# EAGLE design Little-Wire (EAGLE 6.1)
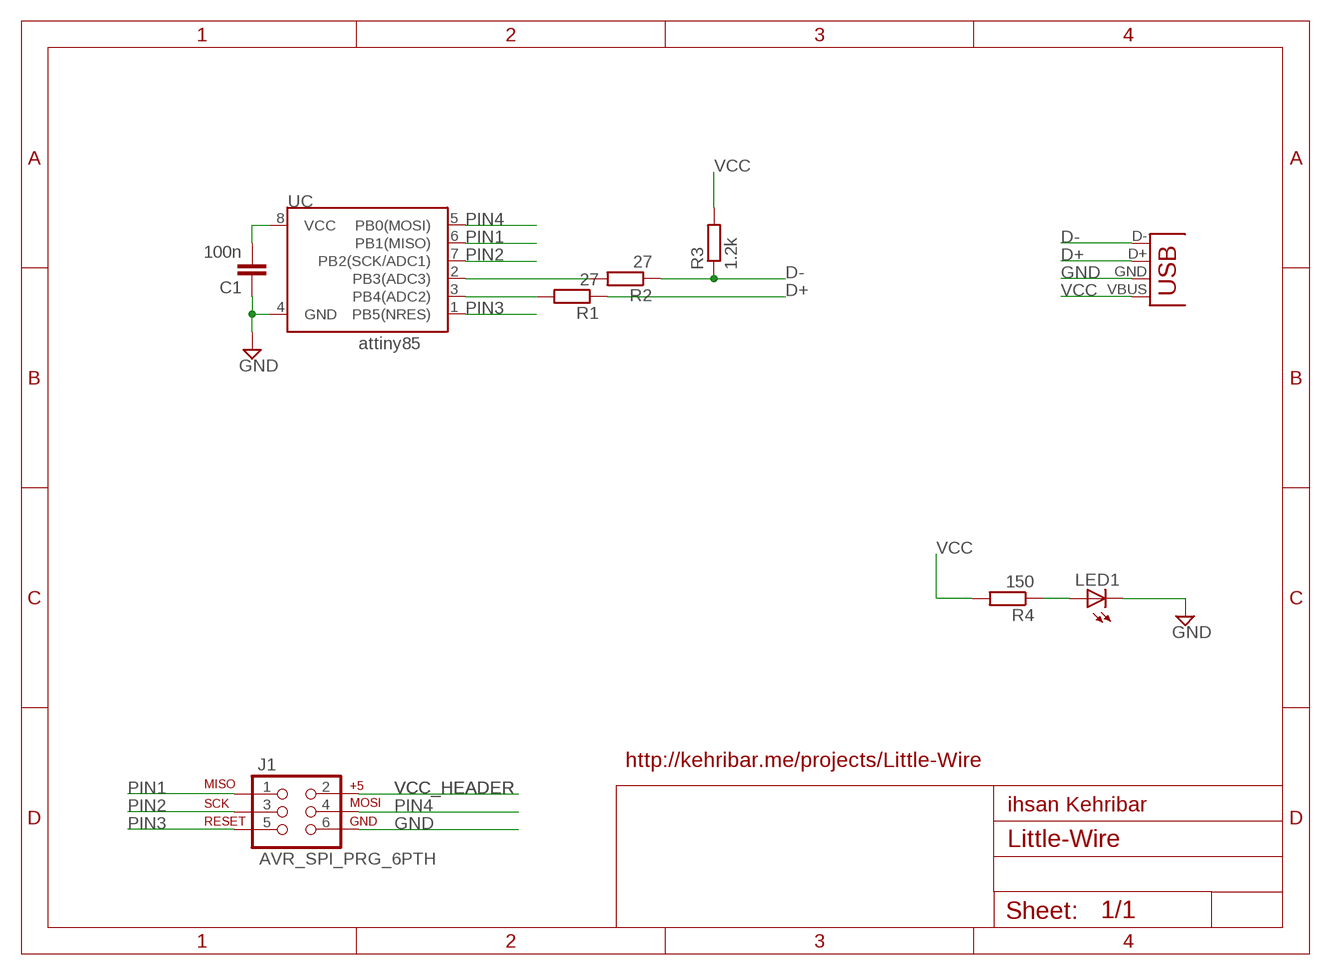
[diagram p0: schematic, sheet 1]

## Parts
C1  100n  C-EU025-025X050  [C025-025X050]
J1  AVR_SPI_PRG_6PTH  [2X3]
LED1  LED3MM  [LED3MM]
R1  27  R-EU_0204/5  [0204/5]
R2  27  R-EU_0204/5  [0204/5]
R3  1.2k  R-EU_0204/5  [0204/5]
R4  150  R-EU_0204/5  [0204/5]
UC  ATTINY45DIP8  [DIP08]
X1  USB-A-H  [USB-A-H]

## Nets
D+: R1.1 X1.D+(D-)
D-: R2.1 R3.1 X1.D-(D+)
GND: C1.1 J1.6 LED1.K(C) UC.4(GND) X1.GND(VBUS)
N$1: R2.2 UC.2(PB3(ADC3))
N$2: R1.2 UC.3(PB4(ADC2))
N$3: LED1.A R4.1
PIN1: J1.1 UC.6(PB1(MISO))
PIN2: J1.3 UC.7(PB2(SCK/ADC1))
PIN3: J1.5 UC.1(PB5(NRES))
PIN4: J1.4 UC.5(PB0(MOSI))
VCC: C1.2 R3.2 R4.2 UC.8(VCC) X1.VBUS(GND)
VCC_HEADER: J1.2

## Notes on the sheet
- attiny85
- http://kehribar.me/projects/Little-Wire
- ihsan Kehribar

## Library data of the parts
C1 = rcl:C-EU: CAPACITOR, European symbol
J1 = SparkFun:AVR_SPI_PRG_6: AVR ISP 6 Pin This is the reduced ISP connector for AVR programming. Common on Arduino. This footprint will take up less PCB space and can be used with a 10-pin to 6-pin adapter such as SKU: BOB-08508
LED1 = led:LED: LED OSRAM: - CHIPLED LG R971, LG N971, LY N971, LG Q971, LY Q971, LO R971, LY R971 LH N974, LH R974 LS Q976, LO Q976, LY Q976 LO Q996 - Hyper CHIPLED LW Q18S LB Q993, LB Q99A, LB R99A - SideLED LS A670, LO A670, LY A670, LG A670, LP A670 LB A673, LV A673, LT A673, LW A673 LH A674 LY A675 LS A676, LA A676, LO A676, LY A676, LW A676 LS A679, LY A679, LG A679 - Hyper Micro SIDELED® LS Y876, LA Y876, LO Y876, LY Y876 LT Y87S - SmartLED LW L88C, LW L88S LB L89C, LB L89S, LG L890 LS L89K, LO L89K, LY L89K LS L896, LA L896, LO L896, LY L896 - TOPLED LS T670, LO T670, LY T670, LG T670, LP T670 LSG T670, LSP T670, LSY T670, LOP T670, LYG T670 LG T671, LOG T671, LSG T671 LB T673, LV T673, LT T673, LW T673 LH T674 LS T676, LA T676, LO T676, LY T676, LB T676, LH T676, LSB T676, LW T676 LB T67C, LV T67C, LT T67C, LS T67K, LO T67K, LY T67K, LW E67C LS E67B, LA E67B, LO E67B, LY E67B, LB E67C, LV E67C, LT E67C LW T67C LS T679, LY T679, LG T679 LS T770, LO T770, LY T770, LG T770, LP T770 LB T773, LV T773, LT T773, LW T773 LH T774 LS E675, LA E675, LY E675, LS T675 LS T776, LA T776, LO T776, LY T776, LB T776 LHGB T686 LT T68C, LB T68C - Hyper Mini TOPLED® LB M676 - Mini TOPLED Santana® LG M470 LS M47K, LO M47K, LY M47K Source: http://www.osram.convergy.de LUXEON: - LUMILED® LXK2-PW12-R00, LXK2-PW12-S00, LXK2-PW14-U00, LXK2-PW14-V00 LXK2-PM12-R00, LXK2-PM12-S00, LXK2-PM14-U00 LXK2-PE12-Q00, LXK2-PE12-R00, LXK2-PE12-S00, LXK2-PE14-T00, LXK2-PE14-U00 LXK2-PB12-K00, LXK2-PB12-L00, LXK2-PB12-M00, LXK2-PB14-N00, LXK2-PB14-P00, LXK2-PB14-Q00 LXK2-PR12-L00, LXK2-PR12-M00, LXK2-PR14-Q00, LXK2-PR14-R00 LXK2-PD12-Q00, LXK2-PD12-R00, LXK2-PD12-S00 LXK2-PH12-R00, LXK2-PH12-S00 LXK2-PL12-P00, LXK2-PL12-Q00, LXK2-PL12-R00 Source: www.luxeon.com KINGBRIGHT: KA-3528ASYC Source: www.kingbright.com
R1-R4 = rcl:R-EU_: RESISTOR, European symbol
UC = SparkFun:ATTINY45: Atmel ATTiny45
X1 = SparkFun:USB: USB Connectors USB-B-PTH is fully proven SKU : PRT-00139 USB-miniB is fully proven SKU : PRT-00587 USB-A-PCB is untested. USB-A-H is throughly reviewed, but untested. Spark Fun Electronics SKU : PRT-00437 USB-B-SMT is throughly reviewed, but untested. Needs silkscreen touching up. USB-A-S has not been used/tested USB-MB-H has not been used/tested

## Board
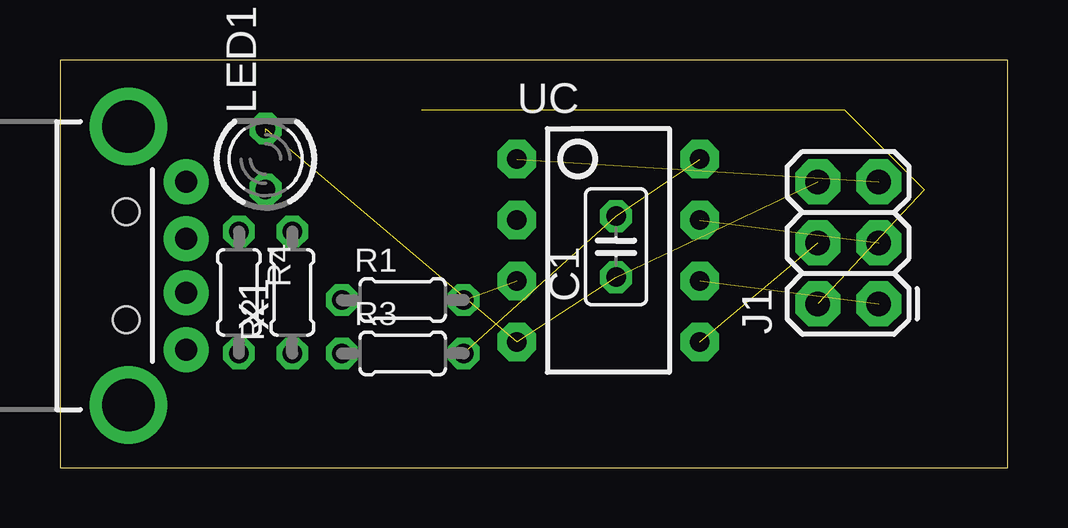
[diagram p1: board, top side]
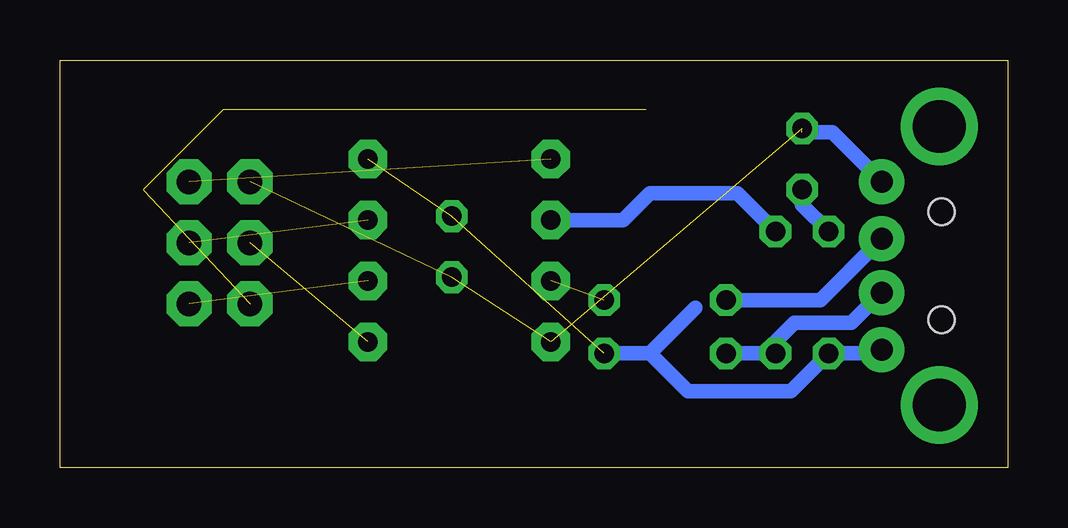
[diagram p2: board, bottom side, seen from below]

Size 39.51 x 16.99 mm. Coordinates in mm from the lower left corner, seen from the top.
Outline: 0,0 39.51,0 39.51,16.97 0,16.99 0,0
Copper layers (1*16): Top 0.035mm / dielectric 1.5mm / Bottom 0.035mm
Design rules: minimum track width 6mil, minimum drill 12mil, track to track 6mil, track to pad 6mil, pad to pad 6mil, via to via 6mil, smd to smd 0mil, copper to edge 10mil, drill to drill 10mil, minimum pad ring 10mil, minimum via ring 6mil, stop-mask expansion 2mil, vias tented up to drill 100mil, thermal gap 10mil

### Footprints (pad centres in the part's own frame; a part is rotated, then mirrored left to right if it is on the bottom)
C025-025X050 = drill 0.813 octagon: 1 -1.27,0; 2 1.27,0
2X3 = drill 1.016 pad 1.88 octagon: 1 0,0; 2 0,2.54; 3 2.54,0; 4 2.54,2.54; 5 5.08,0; 6 5.08,2.54
LED3MM = drill 0.813 octagon: A -1.27,0; K 1.27,0
0204/5 = drill 0.813 octagon: 1 -2.54,0; 2 2.54,0
DIP08 = drill 0.813 pad 1.6 octagon: 1 -3.81,-3.81; 2 -1.27,-3.81; 3 1.27,-3.81; 4 3.81,-3.81; 5 3.81,3.81; 6 1.27,3.81; 7 -1.27,3.81; 8 -3.81,3.81
USB-A-H = drill 0.914 pad 1.88: D+ 2.4,1.127; D- 2.4,-1.127; GND 2.4,3.5; VBUS 2.4,-3.5 | drill 2.2: GND2 0,-5.8; GND3 0,5.8 | hole 1.1: -0.1,2.25; -0.1,-2.25

### Placement (x,y rotation side)
C1  23.18,9.21 90 top
J1  34.13,6.83 90 top
LED1  8.57,12.86 90 top
R1  14.29,6.99 0 top
R2  9.68,7.3 90 top
R3  14.29,4.76 0 top
R4  7.46,7.3 270 top
UC  22.86,9.05 270 top
X1  2.86,8.41 0 top

### Tracks (layer width: path | path; a pad name or v marks a point on that pad's centre or on a via)
D+
  Bottom 0.61: X1.D+ 7.81,6.99 R1.1
D-
  Bottom 0.61: X1.D- 6.51,6.03 8.89,6.03 9.68,5.24 R2.1 R3.1
GND  (4 unrouted)
  Bottom 0.61: X1.GND 7.31,13.97 8.57,13.97
N$1
  Bottom 0.61: R2.2 11.27,11.43 14.92,11.43 16.03,10.32 UC.2
N$2  (1 unrouted)
N$3
  Bottom 0.61: R4.1 8.57,10.95 LED1.A
PIN1  (1 unrouted)
PIN2  (1 unrouted)
PIN3  (1 unrouted)
PIN4  (1 unrouted)
VCC  (2 unrouted)
  Bottom 0.61: X1.VBUS 5.41,4.76 R4.2 9.05,3.17 13.33,3.17 14.92,4.76 | 14.92,4.76 R3.2 | 14.92,4.76 13.02,6.67
VCC_HEADER  (3 unrouted)